# Altium schematic sheet 07-MISC.SchDoc
size A4
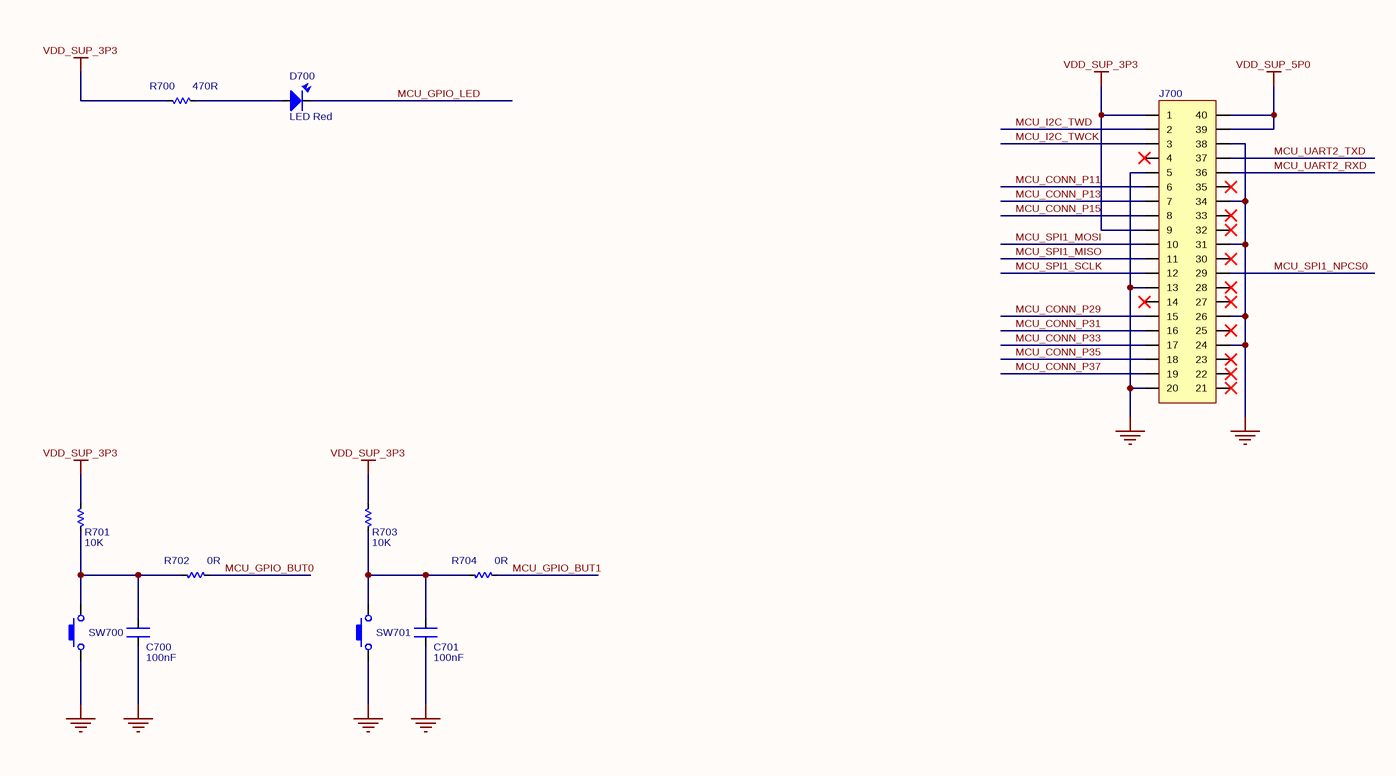
[diagram p0: 07-MISC.SchDoc]

## Parts
C700  value 100nF  [CN-SMD-0603]  (hidden comment: Capacitor)
C701  value 100nF  [CN-SMD-0603]  (hidden comment: Capacitor)
D700  LED Red  [LED-SMD-0805-RED]
J700  JP20x2  [JP20-D2T]  (value not drawn)
R700  value 470R  [RES-SMD-0603]  (hidden comment: Resistor)
R701  value 10K  [RES-SMD-0603]  (hidden comment: Resistor)
R702  value 0R  [RES-SMD-0603]  (hidden comment: Resistor)
R703  value 10K  [RES-SMD-0603]  (hidden comment: Resistor)
R704  value 0R  [RES-SMD-0603]  (hidden comment: Resistor)
SW700  SW2  [SW2-SMD-3x4x2M]  (value not drawn)
SW701  SW2  [SW2-SMD-3x4x2M]  (value not drawn)

## Nets
GND: C700.1 C701.1 J700.5 J700.13 J700.20 J700.24 J700.26 J700.31 J700.34 J700.38 SW700.1 SW701.1
VDD_SUP_3P3: J700.1 J700.9 R700.1 R701.1 R703.1
VDD_SUP_5P0: J700.39 J700.40
MCU_CONN_P11: J700.6
MCU_CONN_P13: J700.7
MCU_CONN_P15: J700.8
MCU_CONN_P29: J700.15
MCU_CONN_P31: J700.16
MCU_CONN_P33: J700.17
MCU_CONN_P35: J700.18
MCU_CONN_P37: J700.19
MCU_GPIO_BUT0: R702.2
MCU_GPIO_BUT1: R704.2
MCU_GPIO_LED: D700.2
MCU_I2C_TWCK: J700.3
MCU_I2C_TWD: J700.2
MCU_SPI1_MISO: J700.11
MCU_SPI1_MOSI: J700.10
MCU_SPI1_NPCS0: J700.29
MCU_SPI1_SCLK: J700.12
MCU_UART2_RXD: J700.36
MCU_UART2_TXD: J700.37
NetC700_2: C700.2 R701.2 R702.1 SW700.2
NetC701_2: C701.2 R703.2 R704.1 SW701.2
NetD700_1: D700.1 R700.2

Not connected (* = marked no-connect by the designer): J700 4* 14* 21* 22* 23* 25* 27* 28* 30* 32* 33* 35*

## Library data of the parts
C700 C701 = Cap: Ceramic Capacitor SMD 0603 100nF ±20% 10V
D700 = LED: Light Emitting Diode SMD 0805 red color
J700 = JP20x2: Double 20-pin jumper
R700 = Res: Resistor SMD 0603 470R 1% 0.1W
R701 R703 = Res: Resistor SMD 0603 10K 1% 0.1W
R702 R704 = Res: Resistor SMD 0603 0R 1% 0.1W
SW700 SW701 = SW2: Switch 2-pin SMD 3x4x2mm